# EAGLE design SAMDi_version6_sot223 (EAGLE 7.1.0)

## Sheet 1 of 2
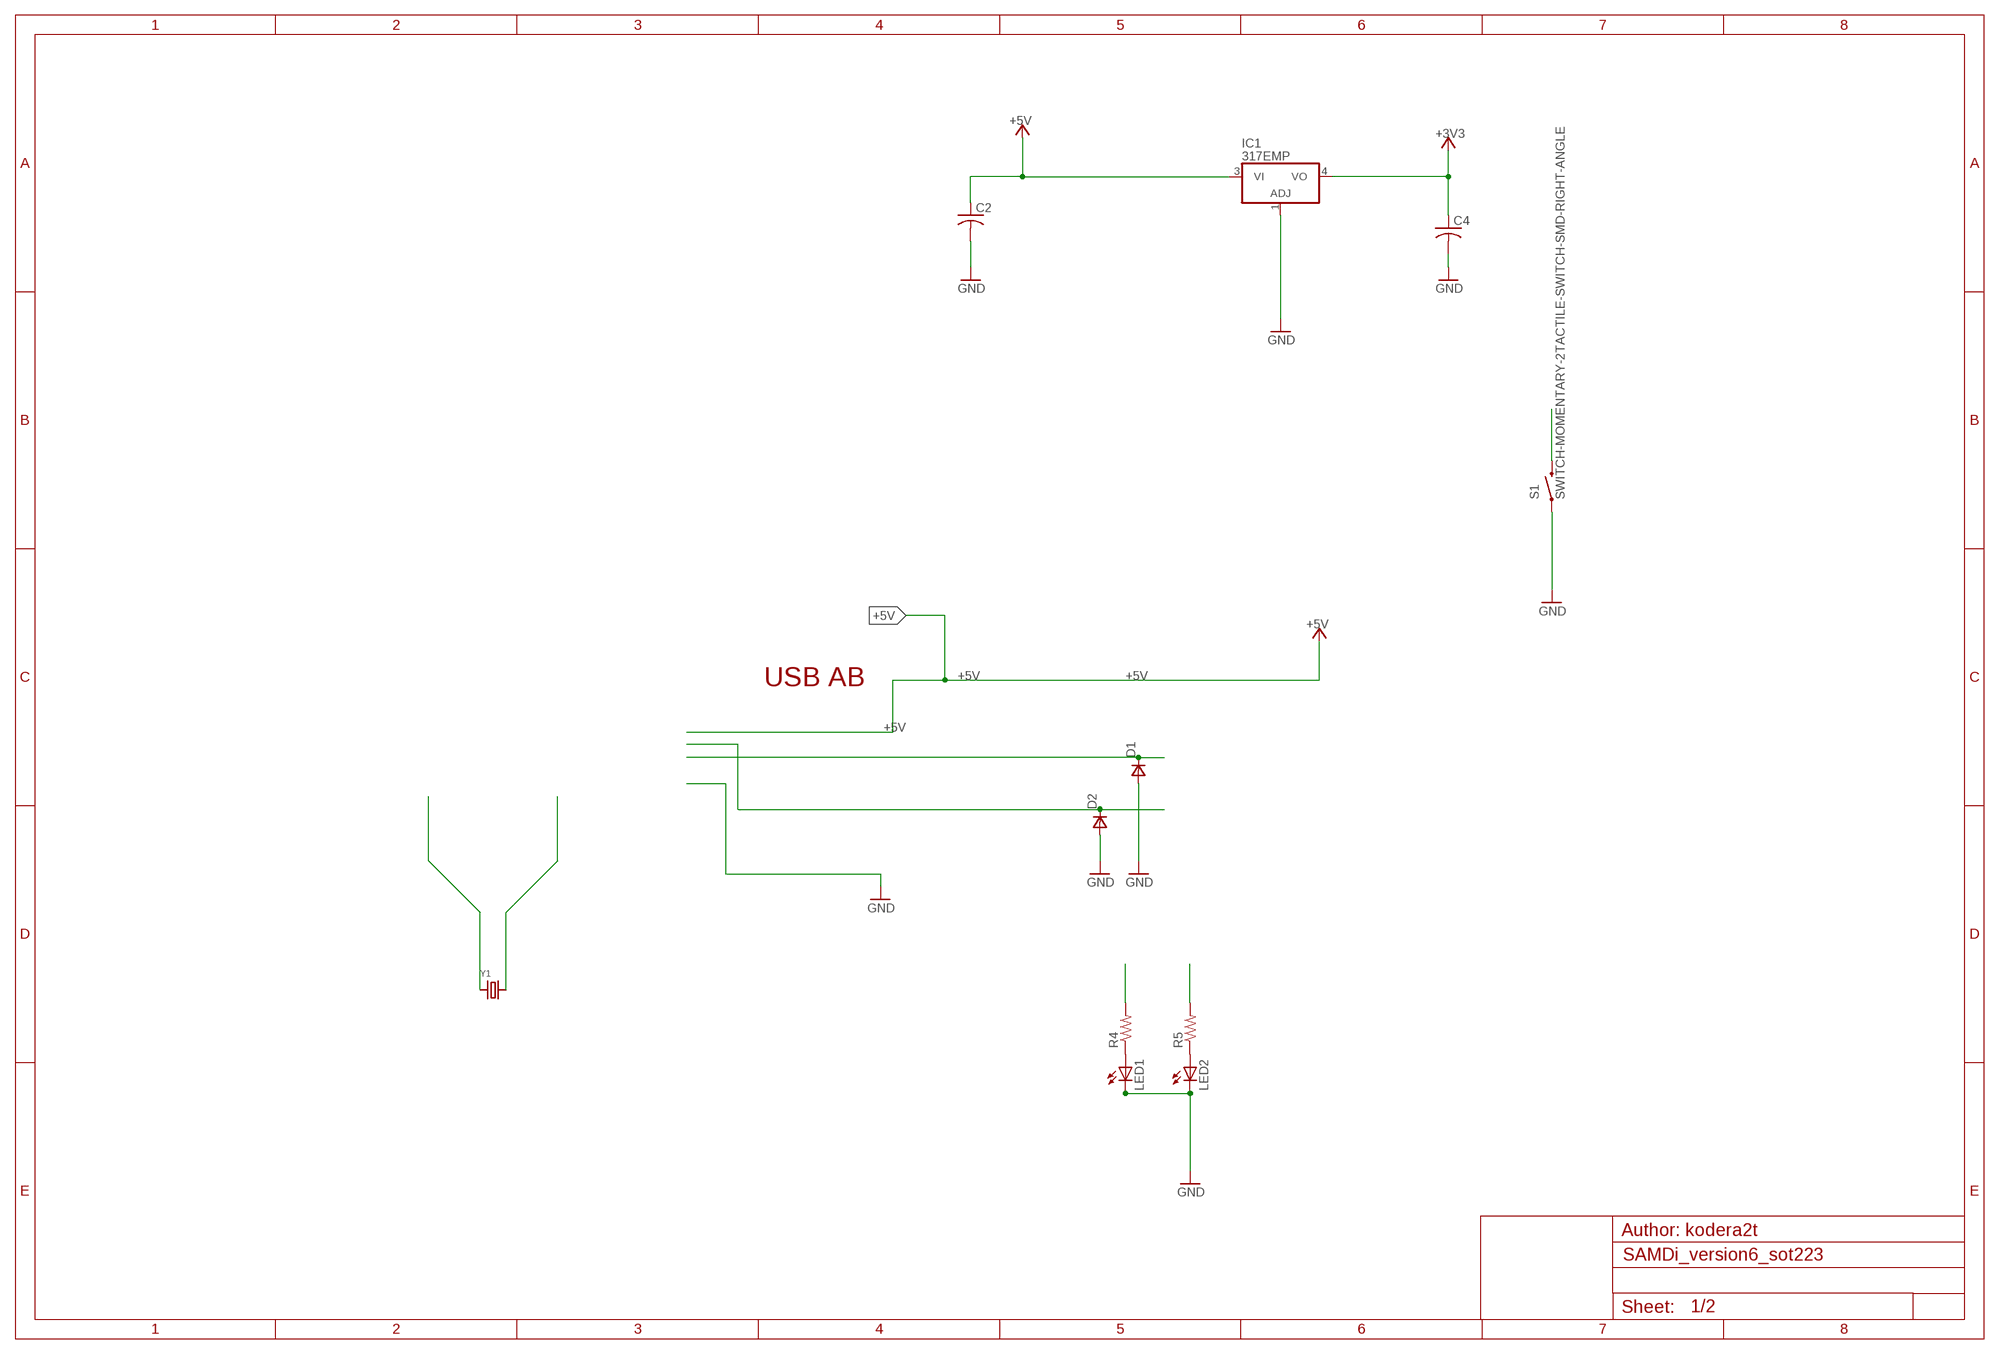
[diagram p0: schematic, sheet 1]

### Parts
C2  C-USC0603  [C0603]
C4  C-USC0603  [C0603]
D1  DSOD323  [SOD323]
D2  DSOD323  [SOD323]
IC1  317EMP  [SOT223]
LED1  LEDCHIP-LED0603  [CHIP-LED0603]
LED2  LEDCHIP-LED0603  [CHIP-LED0603]
R4  R-US_R0603  [R0603]
R5  R-US_R0603  [R0603]
S1  SWITCH-MOMENTARY-2TACTILE-SWITCH-SMD-RIGHT-ANGLE  [TACTILE_SWITCH-SMD-RIGHT-ANGLE]
Y1  CRYSTALTHIN32K  [CRYSTAL_4.9X1.8]

### Nets
+3V3: C4.1 IC1.4(VO) ; also sheet 2
+5V [usbvcc]: C2.1 IC1.3(VI)
GND [gnd]: C2.2 C4.2 D1.2(A) D2.2(A) IC1.1(ADJ) LED1.C LED2.C S1.1 ; also sheet 2
LED1: R4.2 ; also sheet 2
LED2: R5.2 ; also sheet 2
N$4: LED1.A R4.1
N$10: LED2.A R5.1
TARGET_RESET: S1.2 ; also sheet 2
TARGET_USB_N [USBpair]: D2.1(C) ; also sheet 2
TARGET_USB_P [USBpair]: D1.1(C) ; also sheet 2
XTAL11: Y1.2 ; also sheet 2
XTAL22: Y1.1 ; also sheet 2

### Notes on the sheet
- USB AB
- Author: kodera2t

## Sheet 2 of 2
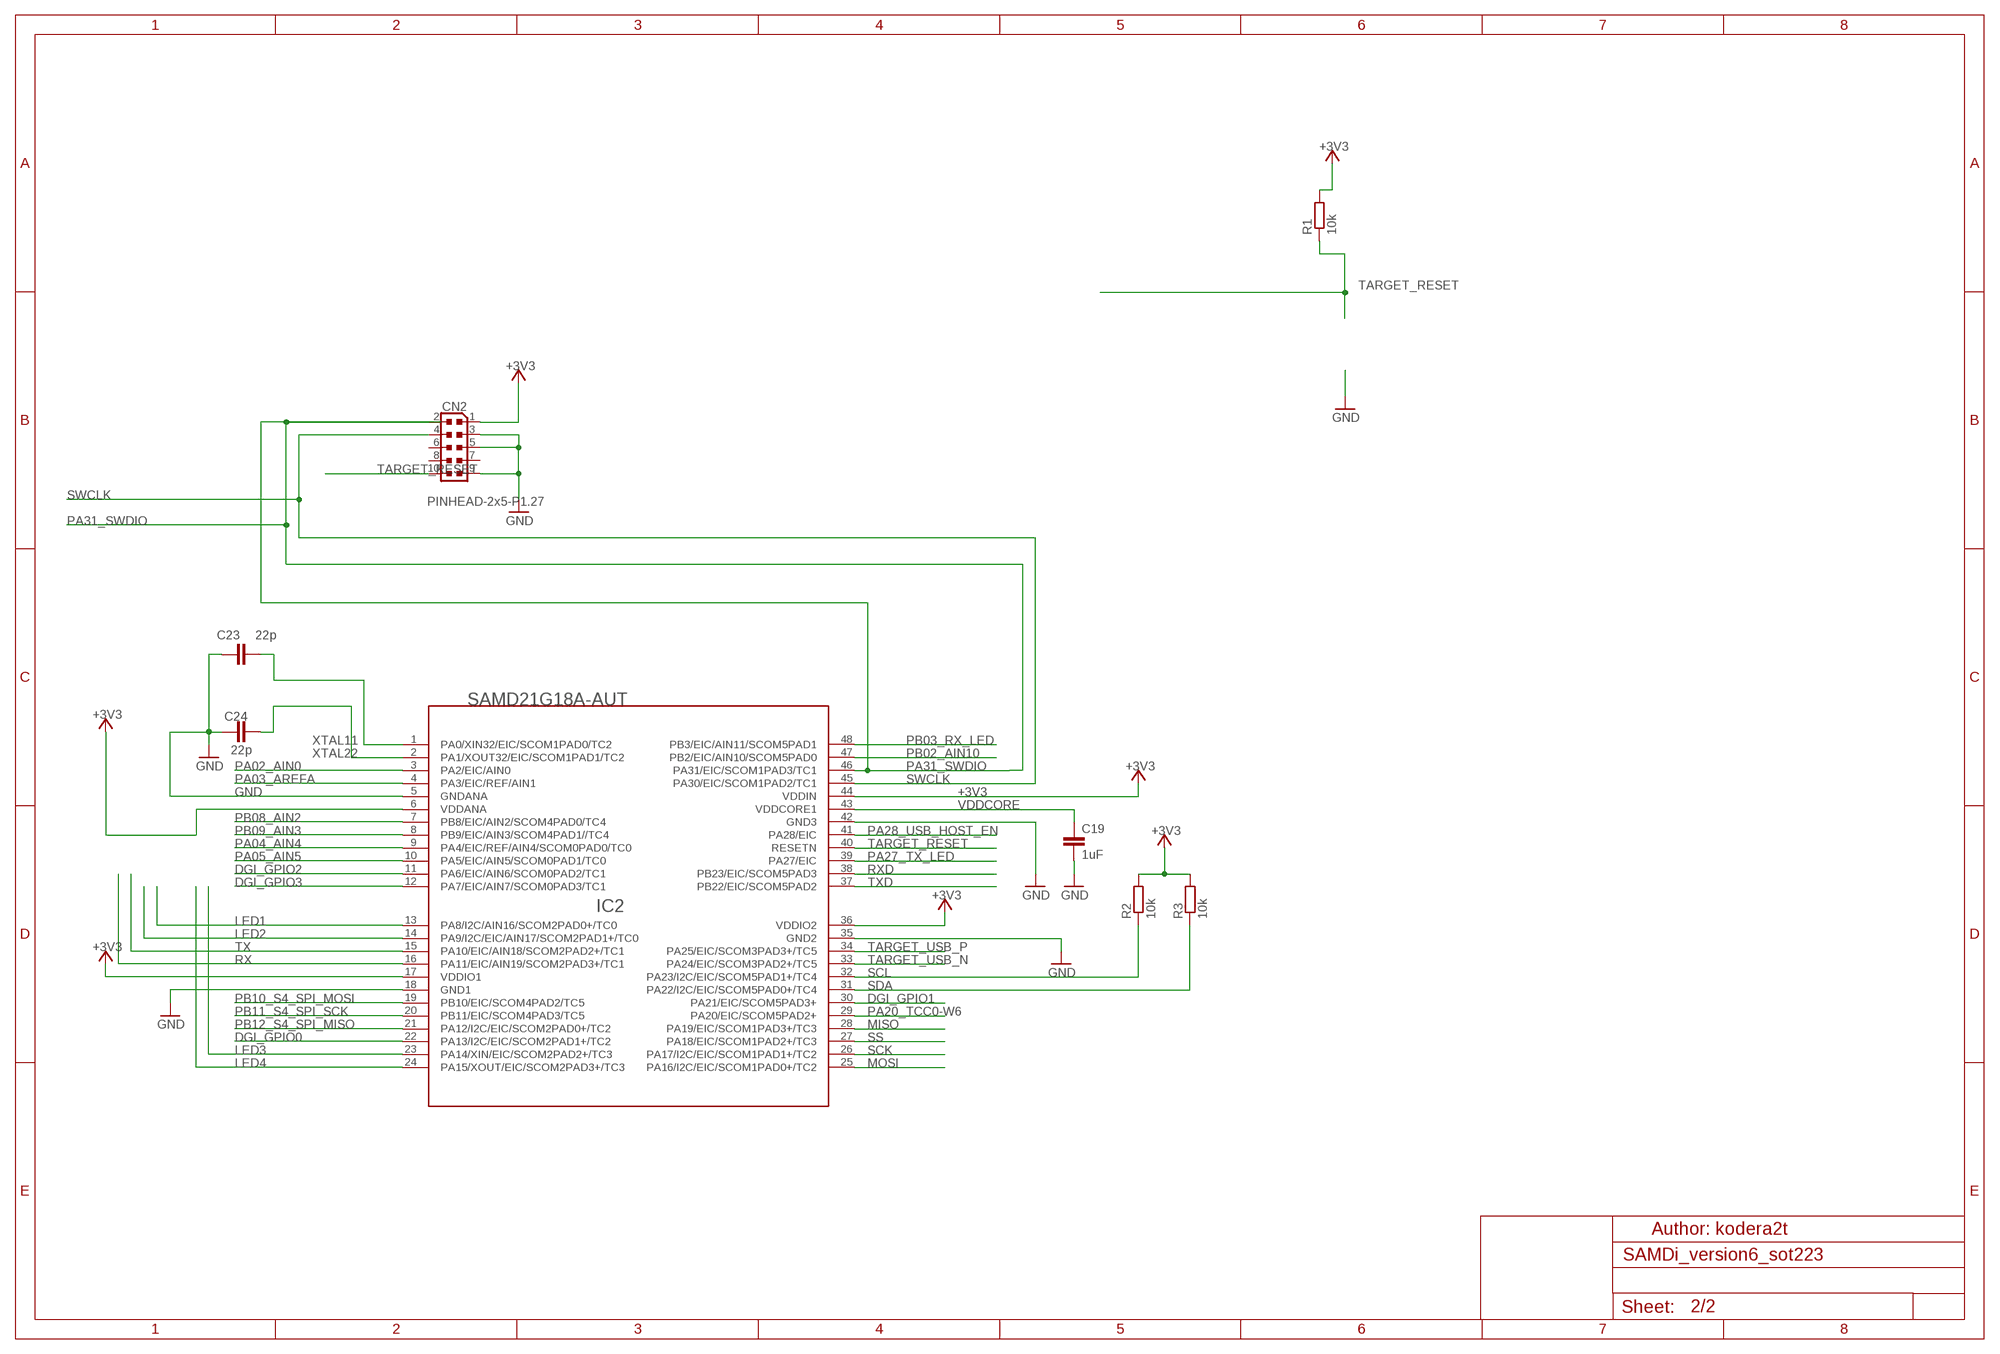
[diagram p1: schematic, sheet 2]

### Parts
C19  1uF  0006_1UF_0603/GRM188R61E105KA12D  [C0603-ROUND]
C23  22p  0014_22PF_0603  [C0603-ROUND]
C24  22p  0014_22PF_0603  [C0603-ROUND]
CN2  PINHEAD-2x5-P1.27  0171_PH127-205DF055G00AROUND-PADS  [PINHEAD_2X05_127]
IC2  SAMD21G18A-AUT  1792_SAMD21G18A-AUT  [TQFP48-7X7]
R1  10k  0028_CR0603JW103L  [R0603-ROUND]
R2  10k  0028_CR0603JW103L  [R0603-ROUND]
R3  10k  0028_CR0603JW103L  [R0603-ROUND]

### Nets
+3V3: CN2.1 IC2.6(VDDANA) IC2.17(VDDIO1) IC2.36(VDDIO2) IC2.44(VDDIN) R1.2 R2.2 R3.2 ; also sheet 1
DGI_GPIO0: IC2.22(PA13/I2C/EIC/SCOM2PAD1+/TC2)
DGI_GPIO1: IC2.30(PA21/EIC/SCOM5PAD3+)
DGI_GPIO2: IC2.11(PA6/EIC/AIN6/SCOM0PAD2/TC1)
DGI_GPIO3: IC2.12(PA7/EIC/AIN7/SCOM0PAD3/TC1)
GND [gnd]: C19.2 C23.1 C24.1 CN2.3 CN2.5 CN2.9 IC2.5(GNDANA) IC2.18(GND1) IC2.35(GND2) IC2.42(GND3) ; also sheet 1
LED1: IC2.13(PA8/I2C/AIN16/SCOM2PAD0+/TC0) ; also sheet 1
LED2: IC2.14(PA9/I2C/EIC/AIN17/SCOM2PAD1+/TC0) ; also sheet 1
LED3: IC2.23(PA14/XIN/EIC/SCOM2PAD2+/TC3)
LED4: IC2.24(PA15/XOUT/EIC/SCOM2PAD3+/TC3)
MISO: IC2.28(PA19/EIC/SCOM1PAD3+/TC3)
MOSI: IC2.25(PA16/I2C/EIC/SCOM1PAD0+/TC2)
PA02_AIN0: IC2.3(PA2/EIC/AIN0)
PA03_AREFA: IC2.4(PA3/EIC/REF/AIN1)
PA04_AIN4: IC2.9(PA4/EIC/REF/AIN4/SCOM0PAD0/TC0)
PA05_AIN5: IC2.10(PA5/EIC/AIN5/SCOM0PAD1/TC0)
PA20_TCC0-W6: IC2.29(PA20/EIC/SCOM5PAD2+)
PA27_TX_LED: IC2.39(PA27/EIC)
PA28_USB_HOST_EN: IC2.41(PA28/EIC)
PA31_SWDIO: CN2.2 IC2.46(PA31/EIC/SCOM1PAD3/TC1)
PB02_AIN10: IC2.47(PB2/EIC/AIN10/SCOM5PAD0)
PB03_RX_LED: IC2.48(PB3/EIC/AIN11/SCOM5PAD1)
PB08_AIN2: IC2.7(PB8/EIC/AIN2/SCOM4PAD0/TC4)
PB09_AIN3: IC2.8(PB9/EIC/AIN3/SCOM4PAD1//TC4)
PB10_S4_SPI_MOSI: IC2.19(PB10/EIC/SCOM4PAD2/TC5)
PB11_S4_SPI_SCK: IC2.20(PB11/EIC/SCOM4PAD3/TC5)
PB12_S4_SPI_MISO: IC2.21(PA12/I2C/EIC/SCOM2PAD0+/TC2)
RX: IC2.16(PA11/EIC/AIN19/SCOM2PAD3+/TC1)
RXD: IC2.38(PB23/EIC/SCOM5PAD3)
SCK: IC2.26(PA17/I2C/EIC/SCOM1PAD1+/TC2)
SCL: IC2.32(PA23/I2C/EIC/SCOM5PAD1+/TC4) R2.1
SDA: IC2.31(PA22/I2C/EIC/SCOM5PAD0+/TC4) R3.1
SS: IC2.27(PA18/EIC/SCOM1PAD2+/TC3)
SWCLK: CN2.4 IC2.45(PA30/EIC/SCOM1PAD2/TC1)
TARGET_RESET: CN2.10 IC2.40(RESETN) R1.1 ; also sheet 1
TARGET_USB_N [USBpair]: IC2.33(PA24/EIC/SCOM3PAD2+/TC5) ; also sheet 1
TARGET_USB_P [USBpair]: IC2.34(PA25/EIC/SCOM3PAD3+/TC5) ; also sheet 1
TX: IC2.15(PA10/EIC/AIN18/SCOM2PAD2+/TC1)
TXD: IC2.37(PB22/EIC/SCOM5PAD2)
VDDCORE: C19.1 IC2.43(VDDCORE1)
XTAL11: C23.2 IC2.1(PA0/XIN32/EIC/SCOM1PAD0/TC2) ; also sheet 1
XTAL22: C24.2 IC2.2(PA1/XOUT32/EIC/SCOM1PAD1/TC2) ; also sheet 1
Unconnected: CN2.6 CN2.7 CN2.8

### Notes on the sheet
- Author: kodera2t

## Library data of the parts
C2 C4 = resistor:C-US: CAPACITOR, American symbol
C19 = Condensatori:0006_1UF_0603/GRM188R61E105KA12D: 1uF 0603; CASE: 0603; MONTHLY_USAGE: _____; PART_NUMBER: 1uF_0603/GRM188R61E105KA12D; PRICE: _____; SUPPLIER: _____; TYPE: Condensatori
C23 C24 = Condensatori:0014_22PF_0603: 22pF 0603; CASE: 0603; MONTHLY_USAGE: _____; PART_NUMBER: 22pF_0603; PRICE: _____; SUPPLIER: _____; TYPE: Condensatori
CN2 = Connettori:0171_PH127-205DF055G00A: 2x5 PASSO 1,27
D1 D2 = zetex:D: DIODE; MPN: CDSOD323-T05C; OC_FARNELL: 1824860; OC_NEWARK: 79R6078
IC1 = linear:*317: Positive VOLTAGE REGULATOR
IC2 = IntegratedCircuits:1792_SAMD21G18A-AUT: Atmel D21 32bit ARM Cortex-M0 microcontroller - 48 PIN TQFP 256KB flash memory + 32KB SRAM
LED1 LED2 = led:LED: LED OSRAM: - CHIPLED LG R971, LG N971, LY N971, LG Q971, LY Q971, LO R971, LY R971 LH N974, LH R974 LS Q976, LO Q976, LY Q976 LO Q996 - Hyper CHIPLED LW Q18S LB Q993, LB Q99A, LB R99A - SideLED LS A670, LO A670, LY A670, LG A670, LP A670 LB A673, LV A673, LT A673, LW A673 LH A674 LY A675 LS A676, LA A676, LO A676, LY A676, LW A676 LS A679, LY A679, LG A679 - Hyper Micro SIDELED® LS Y876, LA Y876, LO Y876, LY Y876 LT Y87S - SmartLED LW L88C, LW L88S LB L89C, LB L89S, LG L890 LS L89K, LO L89K, LY L89K LS L896, LA L896, LO L896, LY L896 - TOPLED LS T670, LO T670, LY T670, LG T670, LP T670 LSG T670, LSP T670, LSY T670, LOP T670, LYG T670 LG T671, LOG T671, LSG T671 LB T673, LV T673, LT T673, LW T673 LH T674 LS T676, LA T676, LO T676, LY T676, LB T676, LH T676, LSB T676, LW T676 LB T67C, LV T67C, LT T67C, LS T67K, LO T67K, LY T67K, LW E67C LS E67B, LA E67B, LO E67B, LY E67B, LB E67C, LV E67C, LT E67C LW T67C LS T679, LY T679, LG T679 LS T770, LO T770, LY T770, LG T770, LP T770 LB T773, LV T773, LT T773, LW T773 LH T774 LS E675, LA E675, LY E675, LS T675 LS T776, LA T776, LO T776, LY T776, LB T776 LHGB T686 LT T68C, LB T68C - Hyper Mini TOPLED® LB M676 - Mini TOPLED Santana® LG M470 LS M47K, LO M47K, LY M47K Source: http://www.osram.convergy.de LUXEON: - LUMILED® LXK2-PW12-R00, LXK2-PW12-S00, LXK2-PW14-U00, LXK2-PW14-V00 LXK2-PM12-R00, LXK2-PM12-S00, LXK2-PM14-U00 LXK2-PE12-Q00, LXK2-PE12-R00, LXK2-PE12-S00, LXK2-PE14-T00, LXK2-PE14-U00 LXK2-PB12-K00, LXK2-PB12-L00, LXK2-PB12-M00, LXK2-PB14-N00, LXK2-PB14-P00, LXK2-PB14-Q00 LXK2-PR12-L00, LXK2-PR12-M00, LXK2-PR14-Q00, LXK2-PR14-R00 LXK2-PD12-Q00, LXK2-PD12-R00, LXK2-PD12-S00 LXK2-PH12-R00, LXK2-PH12-S00 LXK2-PL12-P00, LXK2-PL12-Q00, LXK2-PL12-R00 Source: www.luxeon.com KINGBRIGHT: KA-3528ASYC Source: www.kingbright.com
R1-R3 = Resistenze:0028_CR0603JW103L: 10K 0603; CASE: 0603; MONTHLY_USAGE: _____; PART_NUMBER: CR0603JW103L; PRICE: _____; SUPPLIER: _____; TYPE: Resistenze
R4 R5 = resistor:R-US_: RESISTOR, American symbol
S1 = SparkFun-Electromechanical:SWITCH-MOMENTARY-2: Various NO switches- pushbuttons, reed, etc; PROD_ID: COMP-12265
Y1 = microbuilder:CRYSTAL: Crystals HC49UP - Surface Mount Crystal 4.0MHz 18pF +/-30ppm Surface Mount Crystal [Digikey: 535-9857-1-ND] 12.0 MHz Surface Mount Crystal [Digikey: 535-9869-6-ND] 25.0 MHz Surface Mount Crystal [Digikey: 535-9078-1-ND] 2.5 x 2.0mm - MEMs SMT Crystal 16.0 MHz 10pF 20ppm 2.5 x 2.0mm Crystal [Digikey -40-85°C: 535-10923-1-ND] 3.2 x 2.5mm - MEMs SMT Crystal 12.0 MHz 8pF 15ppm 3.2 x 2.5mm Crystal [Digikey: -10-70°C: 644-1047-1-ND -40-125°C: 644-1128-1-ND] 16.0 MHz 8pF 15ppm 3.2 x 2.5mm Crystal [Digikey: -10-70°C: 644-1049-1-ND -40-125°C: 644-1129-2-ND] 16.0 MHz 10pF 10ppm 3.2 x 2.5mm Crystal [Digikey: 644-1100-1-ND] 27.12 MHz 18pF 30ppm 3.2 x 2.5mm Crystal [Digikey: 887-1424-1-ND] 27.12MHz 10pF 10ppm 3.2 x 2.5mm Crystal [Digikey: 887-1329-1-ND] 4.9 x 1.8mm - MEMs SMT Crystal 32.768 KHz 12.5pF 20ppm 4.9 x 1.8mm Crystal [Digikey: SE2415CT-ND] 8.0 x 3.8mm - Surface Mount Crystal 32.768kHz 12.5pF 20ppm -40°C-85°C [Digikey: 535-9166-2-ND] Cylinder 32.768KHz Cylinder Crystal (2x6mm body) [Ex. Digikey: 300-8341-2-ND]

## Net classes
0 default: width 0.203 mm, drill 0.406 mm, clearance 0.203 mm
1 USB: width 0.203 mm, drill 0.305 mm, clearance 0.178 mm
2 gnd: width 0.254 mm, drill 0.254 mm, clearance 0.178 mm
3 usbvcc: width 0.203 mm, drill 0.406 mm, clearance 0.178 mm
4 USBpair: width 0.254 mm, drill 0.406 mm, clearance 0.406 mm

## Board
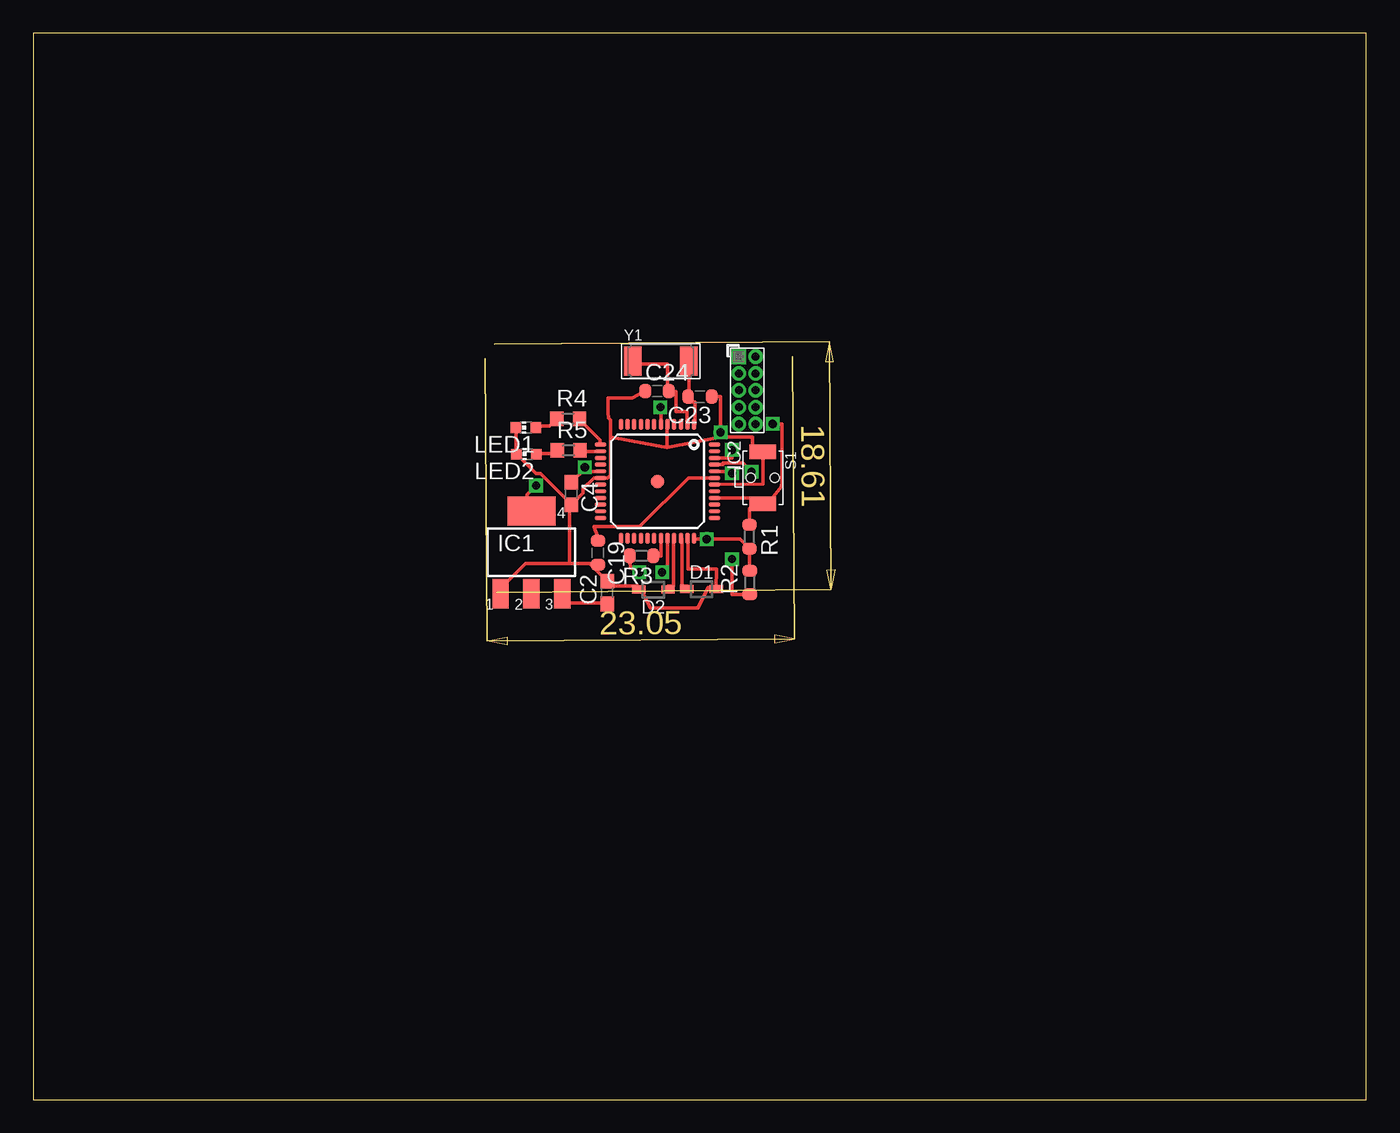
[diagram p2: board, top side]
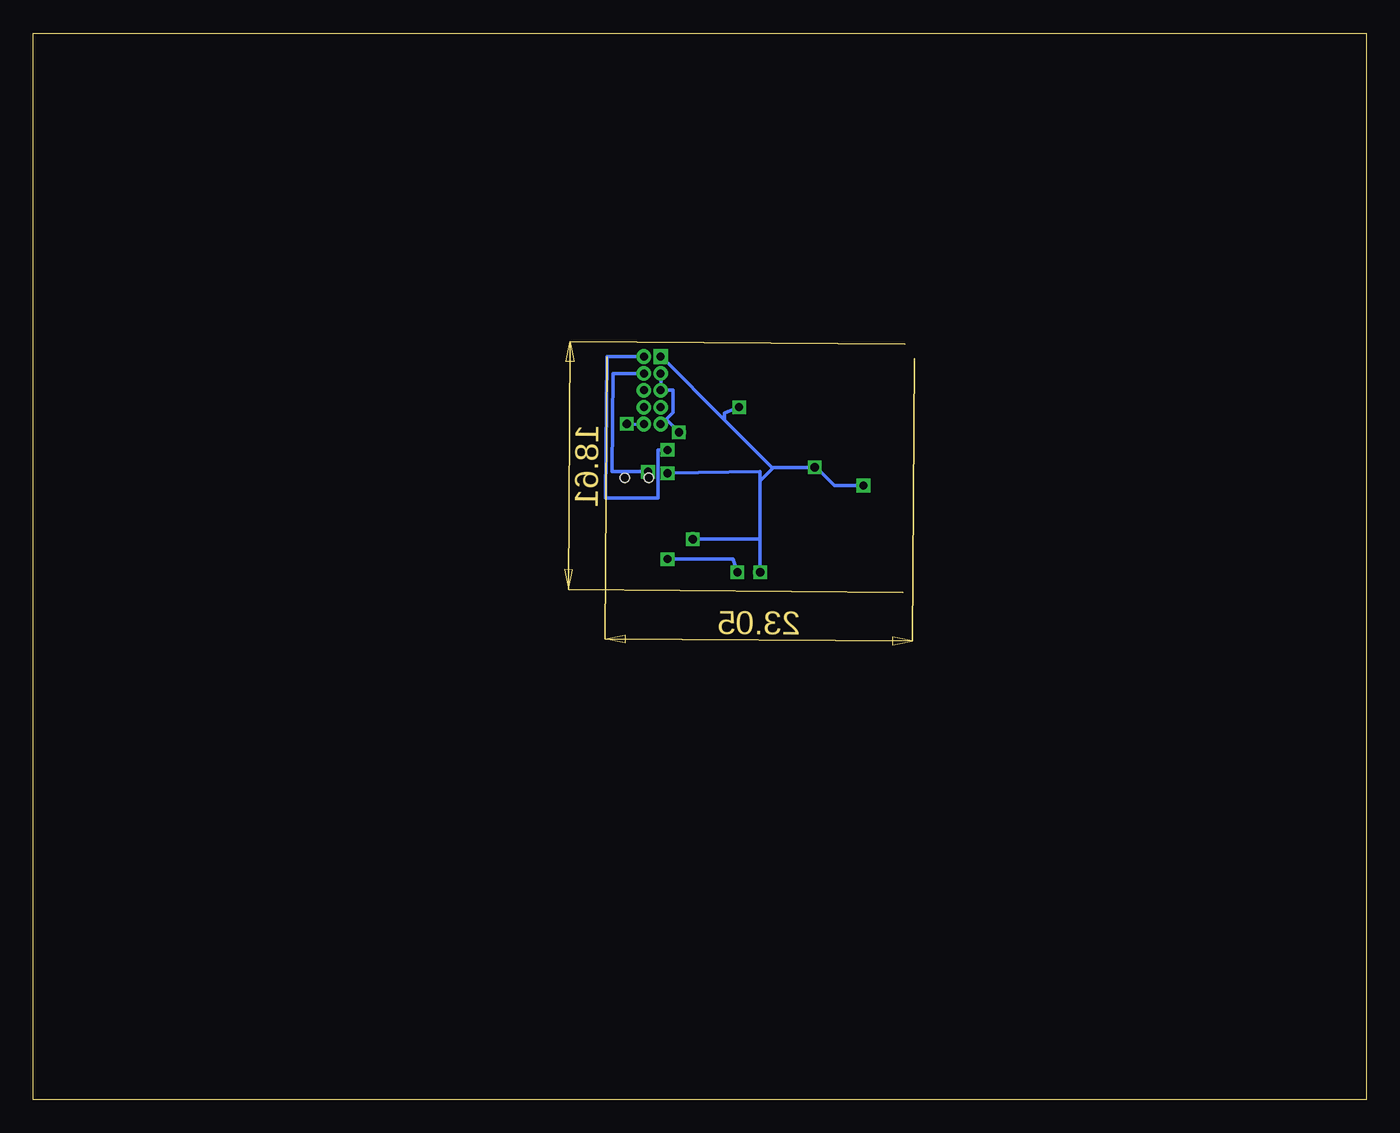
[diagram p3: board, bottom side, seen from below]

Size 100 x 80 mm. Coordinates in mm from the lower left corner, seen from the top.
Outline: 0,0 100,0 100,80 0,80 0,0
Copper layers (1*16): Top 0.035mm / dielectric 1.5mm / Bottom 0.035mm
Design rules "default": minimum track width 10mil, minimum drill 24mil, track to track 8mil, track to pad 8mil, pad to pad 8mil, via to via 8mil, smd to smd 8mil, copper to edge 40mil, drill to drill 8mil, minimum pad ring 10mil, minimum via ring 8mil, stop-mask expansion 4mil, vias tented up to drill 0mil, thermal gap 10mil
tRestrict: area 52.3,50.1 to 54.8,56.5
vRestrict: area 43.1,42.6 to 50.7,50.2

### Footprints (pad centres in the part's own frame; a part is rotated, then mirrored left to right if it is on the bottom)
C0603 = smd 1.1 x 1: 1 -0.85,0; 2 0.85,0
C0603-ROUND = smd 0.898 x 1.1: 1 -0.889,0; 2 0.889,0
PINHEAD_2X05_127 = drill 0.6 pad 1.016 square: 1 -0.635,2.54 | drill 0.6 pad 1.016: 2 0.635,2.54; 3 -0.635,1.27; 4 0.635,1.27; 5 -0.635,0; 6 0.635,0; 7 -0.635,-1.27; 8 0.635,-1.27; 9 -0.635,-2.54; 10 0.635,-2.54
SOD323 = smd 1 x 0.6: 1 -1.1,0; 2 1.1,0
SOT223 = smd 1.219 x 2.235: 1 -2.311,-3.099; 2 0,-3.099; 3 2.311,-3.099 | smd 3.6 x 2.2: 4 0,3.099
TQFP48-7X7 = smd 0.85 x 0.32: 1 -4.275,2.75; 2 -4.275,2.25; 3 -4.275,1.75; 4 -4.275,1.25; 5 -4.275,0.75; 6 -4.275,0.25; 7 -4.275,-0.25; 8 -4.275,-0.75; 9 -4.275,-1.25; 10 -4.275,-1.75; 11 -4.275,-2.25; 12 -4.275,-2.75; 25 4.275,-2.75; 26 4.275,-2.25; 27 4.275,-1.75; 28 4.275,-1.25; 29 4.275,-0.75; 30 4.275,-0.25; 31 4.275,0.25; 32 4.275,0.75; 33 4.275,1.25; 34 4.275,1.75; 35 4.275,2.25; 36 4.275,2.75 | smd 0.32 x 0.85: 13 -2.75,-4.275; 14 -2.25,-4.275; 15 -1.75,-4.275; 16 -1.25,-4.275; 17 -0.75,-4.275; 18 -0.25,-4.275; 19 0.25,-4.275; 20 0.75,-4.275; 21 1.25,-4.275; 22 1.75,-4.275; 23 2.25,-4.275; 24 2.75,-4.275; 37 2.75,4.275; 38 2.25,4.275; 39 1.75,4.275; 40 1.25,4.275; 41 0.75,4.275; 42 0.25,4.275; 43 -0.25,4.275; 44 -0.75,4.275; 45 -1.25,4.275; 46 -1.75,4.275; 47 -2.25,4.275; 48 -2.75,4.275 | smd 1 x 1: P$1 0,0
CHIP-LED0603 = smd 0.8 x 0.8: A 0,-0.75; C 0,0.75
R0603-ROUND = smd 0.898 x 1.1: 1 -0.889,0; 2 0.889,0
R0603 = smd 1 x 1.1: 1 -0.85,0; 2 0.85,0
TACTILE_SWITCH-SMD-RIGHT-ANGLE = smd 1.1 x 2: 1 -1.95,0; 2 1.95,0 | hole 0.7: 0,0.9; 0,-0.9
CRYSTAL_4.9X1.8 = smd 1.3 x 2.2: 1 -2.1,0; 2 2.1,0

### Placement (x,y rotation side)
C2  43.05,38.04 90 top
C4  40.35,45.47 270 top
C19  42.35,41.02 270 top
C23  50.01,52.74 180 top
C24  46.8,53.15 0 top
CN2  53.56,53.21 0 top
D1  50.13,38.29 0 top
D2  46.51,38.26 180 top
IC1  37.37,41.05 0 top
IC2  46.83,46.39 270 top
LED1  36.96,50.42 90 top
LED2  36.99,48.42 90 top
R1  53.72,42.23 270 top
R2  53.75,38.8 90 top
R3  45.62,40.8 180 top
R4  40.13,51.09 0 top
R5  40.16,48.7 0 top
S1  54.74,46.64 270 top
Y1  47.09,55.4 0 top

### Tracks (layer width: path | path; a pad name or v marks a point on that pad's centre or on a via)
+3V3  (via drill 0.61)
  Top 0.254: IC2.36 49.61,42.06 v50.52,42.06 53.03,42.06 53.72,41.38 R1.2 53.72,39.78 R2.2 | C4.1 40.46,46.41 41.38,47.32 v41.38,47.43 41.38,47.14 IC2.17 | v45.49,39.55 45.49,39.66 44.8,39.89 R3.2 | v37.72,46.06 37.03,45.38 37.03,44.23 IC1.4 | IC2.44 52.1,47.14 v52.42,46.99 | IC2.6 47.09,51.82 v47.05,51.94
  Bottom 0.254: 44.58,47.43 v41.38,47.43 v41.37,47.43 41.26,47.43 39.89,46.06 v37.72,46.06 | 48.13,50.99 52.92,55.78 CN2.1 | 48.13,50.99 44.58,47.43 | 45.49,46.41 45.49,42.06 | 45.49,42.06 v45.49,39.55 | 45.49,46.41 44.58,47.32 44.58,47.43 | 45.49,42.06 v50.52,42.06 | v52.42,46.99 45.49,47.12 45.49,46.41 | v47.05,51.94 48.13,51.5 48.13,50.99
+5V
  Top 0.254: C2.1 42.98,37.26 40.01,37.26 39.32,37.95 IC1.3
GND  (via drill 0.61)
  Top 0.254: 41.72,40.23 42.45,40.22 C19.2 | 41.72,40.23 42.98,38.98 C2.2 43.09,38.86 43.43,38.52 45.38,38.52 D2.2 45.49,38.41 46.32,36.87 49.87,36.87 50.63,38.41 51.21,38.41 D1.2 51.27,39.81 49.12,39.81 49.12,42.11 IC2.35 | 41.72,40.23 40.23,40.23 | 40.23,40.23 36.92,40.23 34.75,38.06 IC1.1 | C24.1 44.93,52.64 43.12,52.64 43.12,51.53 43.14,51.12 43.32,50.98 43.32,49.72 | LED1.C 36.23,50.41 36.23,48.46 LED2.C 36.35,48.35 37.72,46.98 38.06,46.98 40.35,44.69 C4.2 | C4.2 40.46,44.69 41.26,45.49 41.26,45.83 42.06,46.63 42.52,46.63 IC2.18 42.63,46.63 43.09,46.63 43.32,46.86 43.32,49.72 | 51.55,49.72 53.94,49.71 53.95,48.69 S1.1 54.74,46.17 IC2.42 | 43.32,49.72 47.53,48.93 | 47.53,48.93 51.55,49.72 | 51.55,49.72 v51.55,50.06 51.55,52.74 C23.1 | 40.23,40.23 40.23,44.58 C4.2 | IC2.5 47.56,50.66 47.53,48.93
  Bottom 0.254: CN2.3 52.92,54.41 52.92,53.38 CN2.5 52.01,53.21 52.01,51.55 52.58,50.98 52.69,50.98 52.92,50.75 CN2.9 52.46,50.98 v51.55,50.06
LED1
  Top 0.254: IC2.13 42.52,49.15 42.52,49.49 41.03,50.98 R4.2
LED2
  Top 0.254: IC2.14 41.01,48.64 R5.2
N$1  (via drill 0.61)
  other vias: 50.51,42.04
N$2  (via drill 0.61)
  other vias: 45.47,39.56
N$4
  Top 0.254: LED1.A 37.72,50.52 38.75,50.52 39.2,50.98 R4.1
N$5  (via drill 0.61)
  other vias: 37.72,46.07
N$6  (via drill 0.61)
  other vias: 51.56,50.07
N$7  (via drill 0.61)
  other vias: 55.47,50.7
N$10
  Top 0.254: LED2.A 37.83,48.46 38.98,48.46 39.2,48.69 R5.1
PA31_SWDIO  (via drill 0.61)
  Top 0.254: IC2.46 52.42,48.14 v52.42,48.74
  Bottom 0.254: v52.42,48.74 53.15,48.74 53.15,45.15 57.05,45.15 56.96,55.75 CN2.2
SCL  (via drill 0.61)
  Top 0.254: R2.1 52.42,37.91 v52.42,40.55 | v47.18,39.56 47.58,39.78 IC2.32
  Bottom 0.254: v52.42,40.55 47.5,40.55 v47.18,39.56
SDA
  Top 0.254: R3.1 47.08,40.8 IC2.31
SWCLK  (via drill 0.61)
  Top 0.254: IC2.45 51.75,47.64 51.75,47.75 53.24,47.75 v53.88,47.12
  Bottom 0.254: v53.88,47.12 56.58,47.12 56.52,54.45 CN2.4
TARGET_RESET  (via drill 0.61)
  Top 0.254: R1.1 53.72,44.35 53.95,44.58 S1.2 | v55.48,50.69 56.17,50.69 56.17,46.42 56.15,46 55.09,44.69 54.06,44.69 S1.2 | IC2.40 54.01,45.14 S1.2
  Bottom 0.254: v55.48,50.69 54.29,50.63 CN2.10
TARGET_USB_N
  Top 0.254: IC2.33 48.02,42.11 48.02,38.54 47.61,38.54 D2.1
TARGET_USB_P
  Top 0.254: IC2.34 48.69,42.11 48.69,38.54 49.06,38.54 D1.1
VDDCORE
  Top 0.254: IC2.43 51.09,46.63 49.15,46.63 45.49,42.98 42.06,42.98 42.35,42.13 C19.1
XTAL11
  Top 0.254: IC2.1 49.62,50.66 49.62,52.32 49.12,52.32 C23.2 49.19,52.74 Y1.2
XTAL22
  Top 0.254: IC2.2 49.05,50.66 49.05,51.63 48.23,51.63 48.23,53.12 47.69,53.12 C24.2 47.59,53.15 47.59,55.18 44.98,55.18 Y1.1